# Altium schematic sheet Digital ICSP Test Points.SchDoc: Digital ICSP Outputs
size A4
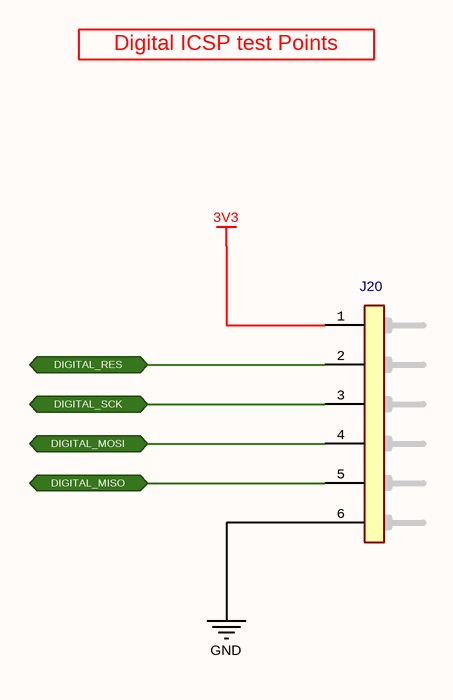
[diagram p0: Digital ICSP Test Points.SchDoc]

## Parts
J20  2.54 mm Pitch 6P Male Connector  [6P Header]  (value not drawn)

## Ports
DIGITAL_MISO (bidir), DIGITAL_MOSI (bidir), DIGITAL_RES (bidir), DIGITAL_SCK (bidir)

## Nets
3V3: J20.1(Pin-1)
GND: J20.6(Pin-6)
DIGITAL_MISO: J20.5(Pin-5) ; port DIGITAL_MISO
DIGITAL_MOSI: J20.4(Pin-4) ; port DIGITAL_MOSI
DIGITAL_RES: J20.2(Pin-2) ; port DIGITAL_RES
DIGITAL_SCK: J20.3(Pin-3) ; port DIGITAL_SCK

## Notes on the sheet
- Digital ICSP test Points
- Title
- Size:
- Date:
- A4
- Number:
- Time:
- Revision:
- Sheet
- of
- File:

## Library data of the parts
J20 = Connector - Male Header 6P (2.54): Headers & Wire Housings BREAKAWAY HDR VERT 6; Manufacturer Name: Molex; Position: 6; Row: 1; Pitch: 2.54 mm; Manufacturer Part Number: 22-28-4063; Mouser Part Number: 538-22-28-4063; ROHS: Yes; ComponentLink1Description: DataSheet; ComponentLink1URL: https://www.mouser.com.tr/datasheet/2/276/0022284063_PCB_HEADERS-228265.pdf; ComponentLink2Description: Mouser; ComponentLink2URL: https://www.mouser.com.tr/ProductDetail/Molex/22-28-4063?qs=sGAEpiMZZMs%252BGHln7q6pm%252BS0pk2Wo0XxVjxVgqsrZJ8%3D; Supplier 1: Mouser; Supplier 2: Digi-Key; Supplier Part Number 2: WM50016-06-ND; Supplier Part Number 1: 538-22-28-4063